# EAGLE schematic Measuring Board (EAGLE 6.2)
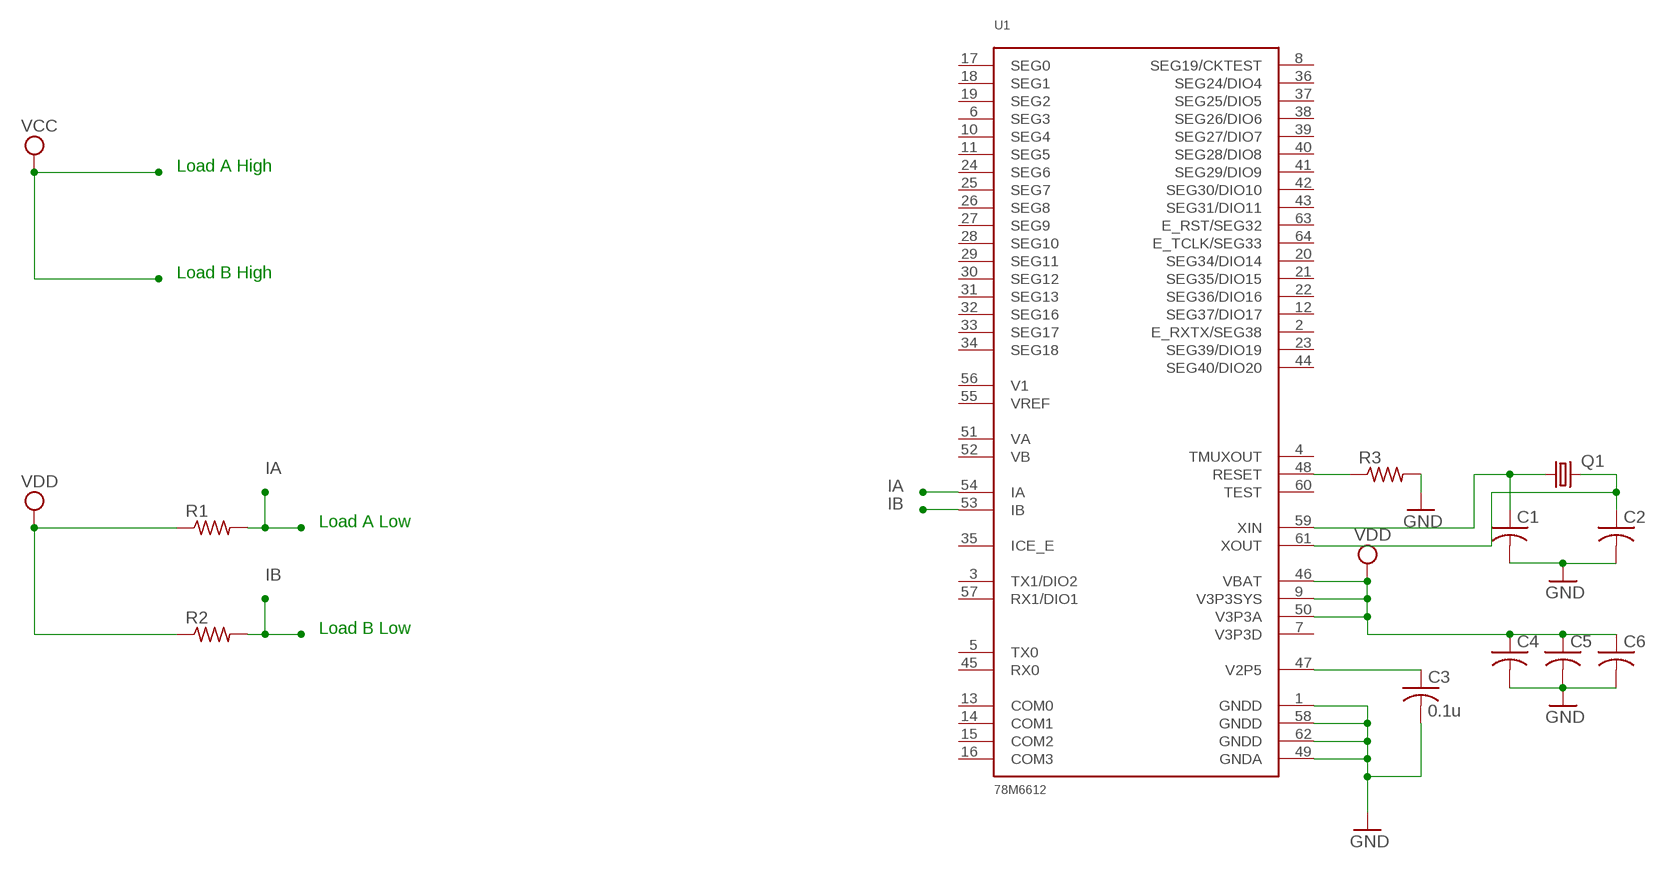
[diagram p0: schematic, sheet 1]

## Parts
C1  C-US025-024X044  [C025-024X044]
C2  C-US025-024X044  [C025-024X044]
C3  0.1u  C-US025-024X044  [C025-024X044]
C4  C-US025-024X044  [C025-024X044]
C5  C-US025-024X044  [C025-024X044]
C6  C-US025-024X044  [C025-024X044]
Q1  CRYSTAL68SMX  [86SMX]
R1  R-US_0204/2V  [0204V]
R2  R-US_0204/2V  [0204V]
R3  R-US_0204/2V  [0204V]
U1  78M6612  [78M6612]

## Nets
GND: C1.2 C2.2 C3.2 C4.2 C5.2 C6.2 R3.2 U1.1(GNDD) U1.49(GNDA) U1.58(GNDD) U1.62(GNDD)
IA: R1.2 U1.54(IA)
IB: R2.2 U1.53(IB)
N$1: C3.1 U1.47(V2P5)
N$5: R3.1 U1.48(RESET)
N$6: C1.1 Q1.1 U1.59(XIN)
N$7: C2.1 Q1.4 U1.61(XOUT)
NEUTRAL: R1.1 R2.1 ; supply symbol labelled VDD
VDD: C4.1 C5.1 C6.1 U1.9(V3P3SYS) U1.46(VBAT) U1.50(V3P3A)
Unconnected: U1.2(E_RXTX/SEG38) U1.3(TX1/DIO2) U1.4(TMUXOUT) U1.5(TX0) U1.6(SEG3) U1.7(V3P3D) U1.8(SEG19/CKTEST) U1.10(SEG4) U1.11(SEG5) U1.12(SEG37/DIO17) U1.13(COM0) U1.14(COM1) U1.15(COM2) U1.16(COM3) U1.17(SEG0) U1.18(SEG1) U1.19(SEG2) U1.20(SEG34/DIO14) U1.21(SEG35/DIO15) U1.22(SEG36/DIO16) U1.23(SEG39/DIO19) U1.24(SEG6) U1.25(SEG7) U1.26(SEG8) U1.27(SEG9) U1.28(SEG10) U1.29(SEG11) U1.30(SEG12) U1.31(SEG13) U1.32(SEG16) U1.33(SEG17) U1.34(SEG18) U1.35(ICE_E) U1.36(SEG24/DIO4) U1.37(SEG25/DIO5) U1.38(SEG26/DIO6) U1.39(SEG27/DIO7) U1.40(SEG28/DIO8) U1.41(SEG29/DIO9) U1.42(SEG30/DIO10) U1.43(SEG31/DIO11) U1.44(SEG40/DIO20) U1.45(RX0) U1.51(VA) U1.52(VB) U1.55(VREF) U1.56(V1) U1.57(RX1/DIO1) U1.60(TEST) U1.63(E_RST/SEG32) U1.64(E_TCLK/SEG33)

## Notes on the sheet
- Load A High
- Load B High
- Load A Low
- Load B Low

## Library data of the parts
C1-C6 = resistor:C-US: CAPACITOR, American symbol
Q1 = crystal:CRYSTAL: CRYSTAL; OC_FARNELL: 6344860; OC_NEWARK: unknown
R1-R3 = resistor:R-US_: RESISTOR, American symbol
U1 = Cool_Electricity:78M6612: 78M6612